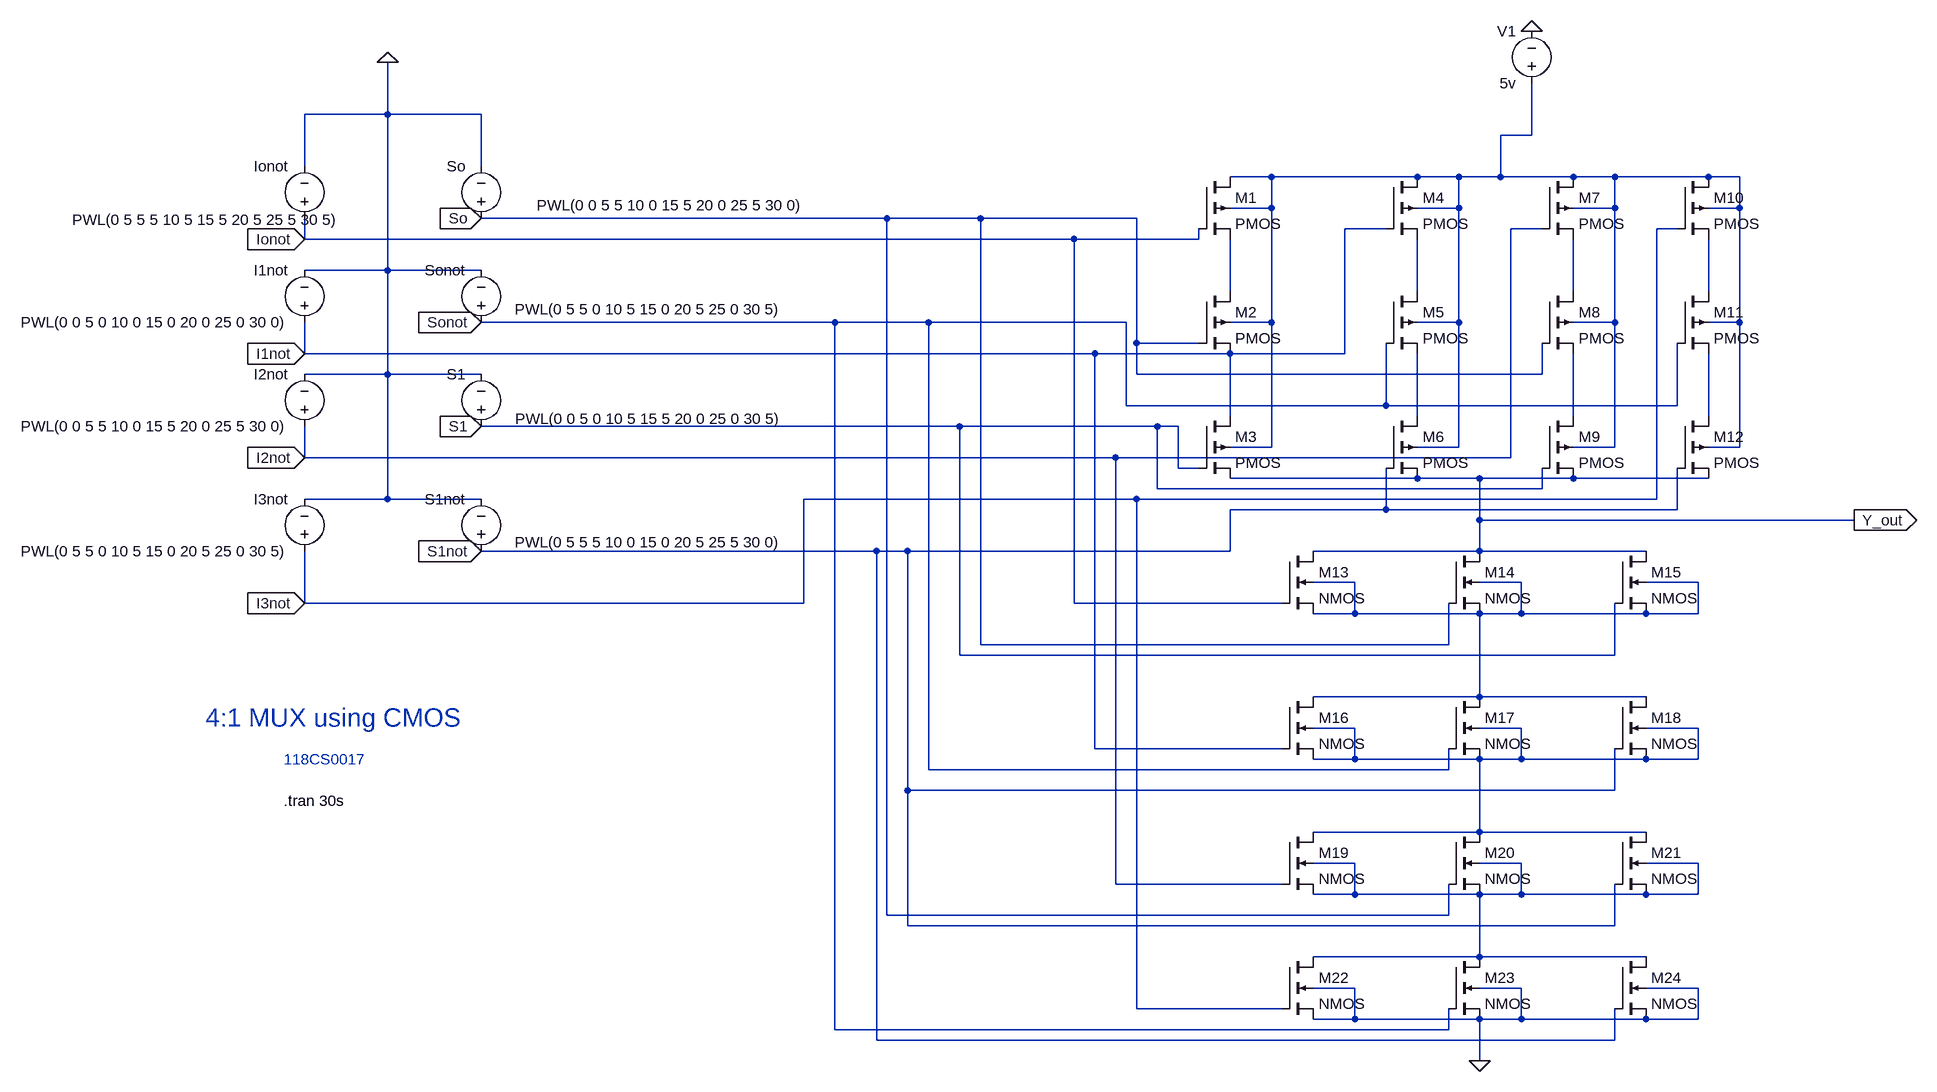
[diagram p0: schematic Draft11.asc]
Draft11.asc, the LTspice schematic file:
Version 4
SHEET 1 880 1492
WIRE -2128 -112 -2128 -192
WIRE -2128 -112 -2256 -112
WIRE -1984 -112 -2128 -112
WIRE -368 -80 -368 -160
WIRE -368 -80 -416 -80
WIRE -2256 -32 -2256 -112
WIRE -1984 -32 -1984 -112
WIRE -768 -16 -832 -16
WIRE -544 -16 -768 -16
WIRE -480 -16 -544 -16
WIRE -416 -16 -416 -80
WIRE -416 -16 -480 -16
WIRE -304 -16 -416 -16
WIRE -240 -16 -304 -16
WIRE -96 -16 -240 -16
WIRE -48 -16 -96 -16
WIRE -768 32 -768 -16
WIRE -768 32 -832 32
WIRE -480 32 -480 -16
WIRE -480 32 -544 32
WIRE -240 32 -240 -16
WIRE -240 32 -304 32
WIRE -48 32 -48 -16
WIRE -48 32 -96 32
WIRE -1360 48 -1984 48
WIRE -1216 48 -1360 48
WIRE -976 48 -1216 48
WIRE -592 64 -656 64
WIRE -352 64 -400 64
WIRE -144 64 -176 64
WIRE -2256 80 -2256 48
WIRE -1072 80 -2256 80
WIRE -880 80 -880 64
WIRE -880 80 -1072 80
WIRE -2128 128 -2128 -112
WIRE -2128 128 -2256 128
WIRE -1984 128 -2128 128
WIRE -832 160 -832 80
WIRE -544 160 -544 80
WIRE -304 160 -304 80
WIRE -96 160 -96 80
WIRE -1440 208 -1984 208
WIRE -1296 208 -1440 208
WIRE -992 208 -1296 208
WIRE -768 208 -768 32
WIRE -768 208 -832 208
WIRE -480 208 -480 32
WIRE -480 208 -544 208
WIRE -240 208 -240 32
WIRE -240 208 -304 208
WIRE -48 208 -48 32
WIRE -48 208 -96 208
WIRE -976 240 -976 48
WIRE -880 240 -976 240
WIRE -2256 256 -2256 208
WIRE -1040 256 -2256 256
WIRE -832 256 -1040 256
WIRE -656 256 -656 64
WIRE -656 256 -832 256
WIRE -2128 288 -2128 128
WIRE -2128 288 -2256 288
WIRE -1984 288 -2128 288
WIRE -976 288 -976 240
WIRE -352 288 -352 240
WIRE -352 288 -976 288
WIRE -992 336 -992 208
WIRE -592 336 -592 240
WIRE -592 336 -992 336
WIRE -144 336 -144 240
WIRE -144 336 -592 336
WIRE -832 352 -832 256
WIRE -544 352 -544 256
WIRE -304 352 -304 256
WIRE -96 352 -96 256
WIRE -1248 368 -1984 368
WIRE -944 368 -1248 368
WIRE -912 368 -944 368
WIRE -768 400 -768 208
WIRE -768 400 -832 400
WIRE -480 400 -480 208
WIRE -480 400 -544 400
WIRE -240 400 -240 208
WIRE -240 400 -304 400
WIRE -48 400 -48 208
WIRE -48 400 -96 400
WIRE -2256 416 -2256 368
WIRE -1008 416 -2256 416
WIRE -400 416 -400 64
WIRE -400 416 -1008 416
WIRE -912 432 -912 368
WIRE -880 432 -912 432
WIRE -544 448 -832 448
WIRE -448 448 -544 448
WIRE -304 448 -448 448
WIRE -96 448 -304 448
WIRE -944 464 -944 368
WIRE -352 464 -352 432
WIRE -352 464 -944 464
WIRE -2128 480 -2128 288
WIRE -2128 480 -2256 480
WIRE -1984 480 -2128 480
WIRE -976 480 -1488 480
WIRE -176 480 -176 64
WIRE -176 480 -976 480
WIRE -592 496 -592 432
WIRE -592 496 -832 496
WIRE -144 496 -144 432
WIRE -144 496 -592 496
WIRE -448 512 -448 448
WIRE 128 512 -448 512
WIRE -1376 560 -1984 560
WIRE -1328 560 -1376 560
WIRE -832 560 -832 496
WIRE -832 560 -1328 560
WIRE -448 560 -448 512
WIRE -448 560 -704 560
WIRE -192 560 -448 560
WIRE -640 608 -704 608
WIRE -384 608 -448 608
WIRE -112 608 -192 608
WIRE -2256 640 -2256 560
WIRE -1488 640 -1488 480
WIRE -1488 640 -2256 640
WIRE -1072 640 -1072 80
WIRE -752 640 -1072 640
WIRE -640 656 -640 608
WIRE -640 656 -704 656
WIRE -448 656 -640 656
WIRE -384 656 -384 608
WIRE -384 656 -448 656
WIRE -192 656 -384 656
WIRE -112 656 -112 608
WIRE -112 656 -192 656
WIRE -1216 704 -1216 48
WIRE -496 704 -496 640
WIRE -496 704 -1216 704
WIRE -1248 720 -1248 368
WIRE -240 720 -240 640
WIRE -240 720 -1248 720
WIRE -448 784 -448 656
WIRE -448 784 -704 784
WIRE -192 784 -448 784
WIRE -640 832 -704 832
WIRE -384 832 -448 832
WIRE -112 832 -192 832
WIRE -1040 864 -1040 256
WIRE -752 864 -1040 864
WIRE -640 880 -640 832
WIRE -640 880 -704 880
WIRE -448 880 -640 880
WIRE -384 880 -384 832
WIRE -384 880 -448 880
WIRE -192 880 -384 880
WIRE -112 880 -112 832
WIRE -112 880 -192 880
WIRE -1296 896 -1296 208
WIRE -496 896 -496 864
WIRE -496 896 -1296 896
WIRE -1328 928 -1328 560
WIRE -240 928 -240 864
WIRE -240 928 -1328 928
WIRE -448 992 -448 880
WIRE -448 992 -704 992
WIRE -192 992 -448 992
WIRE -640 1040 -704 1040
WIRE -384 1040 -448 1040
WIRE -112 1040 -192 1040
WIRE -1008 1072 -1008 416
WIRE -752 1072 -1008 1072
WIRE -640 1088 -640 1040
WIRE -640 1088 -704 1088
WIRE -448 1088 -640 1088
WIRE -384 1088 -384 1040
WIRE -384 1088 -448 1088
WIRE -192 1088 -384 1088
WIRE -112 1088 -112 1040
WIRE -112 1088 -192 1088
WIRE -1360 1120 -1360 48
WIRE -496 1120 -496 1072
WIRE -496 1120 -1360 1120
WIRE -1328 1136 -1328 928
WIRE -240 1136 -240 1072
WIRE -240 1136 -1328 1136
WIRE -448 1184 -448 1088
WIRE -448 1184 -704 1184
WIRE -192 1184 -448 1184
WIRE -640 1232 -704 1232
WIRE -384 1232 -448 1232
WIRE -112 1232 -192 1232
WIRE -976 1264 -976 480
WIRE -752 1264 -976 1264
WIRE -640 1280 -640 1232
WIRE -640 1280 -704 1280
WIRE -448 1280 -640 1280
WIRE -384 1280 -384 1232
WIRE -384 1280 -448 1280
WIRE -192 1280 -384 1280
WIRE -112 1280 -112 1232
WIRE -112 1280 -192 1280
WIRE -1440 1296 -1440 208
WIRE -496 1296 -496 1264
WIRE -496 1296 -1440 1296
WIRE -1376 1312 -1376 560
WIRE -240 1312 -240 1264
WIRE -240 1312 -1376 1312
WIRE -448 1344 -448 1280
FLAG -368 -240 0
FLAG -448 1344 0
FLAG 128 512 Y_out
IOPIN 128 512 Out
FLAG -2128 -192 0
FLAG -2256 80 Ionot
IOPIN -2256 80 In
FLAG -2256 256 I1not
IOPIN -2256 256 In
FLAG -2256 416 I2not
IOPIN -2256 416 In
FLAG -2256 640 I3not
IOPIN -2256 640 In
FLAG -1984 48 So
IOPIN -1984 48 In
FLAG -1984 208 Sonot
IOPIN -1984 208 In
FLAG -1984 368 S1
IOPIN -1984 368 In
FLAG -1984 560 S1not
IOPIN -1984 560 In
SYMBOL pmos4 -880 -16 R0
SYMATTR InstName M1
SYMBOL pmos4 -880 160 R0
SYMATTR InstName M2
SYMBOL pmos4 -880 352 R0
SYMATTR InstName M3
SYMBOL pmos4 -592 -16 R0
SYMATTR InstName M4
SYMBOL pmos4 -592 160 R0
SYMATTR InstName M5
SYMBOL pmos4 -592 352 R0
SYMATTR InstName M6
SYMBOL pmos4 -352 -16 R0
SYMATTR InstName M7
SYMBOL pmos4 -352 160 R0
SYMATTR InstName M8
SYMBOL pmos4 -352 352 R0
SYMATTR InstName M9
SYMBOL pmos4 -144 -16 R0
SYMATTR InstName M10
SYMBOL pmos4 -144 160 R0
SYMATTR InstName M11
SYMBOL pmos4 -144 352 R0
SYMATTR InstName M12
SYMBOL nmos4 -752 560 R0
SYMATTR InstName M13
SYMBOL nmos4 -496 560 R0
SYMATTR InstName M14
SYMBOL nmos4 -240 560 R0
SYMATTR InstName M15
SYMBOL nmos4 -752 784 R0
SYMATTR InstName M16
SYMBOL nmos4 -496 784 R0
SYMATTR InstName M17
SYMBOL nmos4 -240 784 R0
SYMATTR InstName M18
SYMBOL nmos4 -752 992 R0
SYMATTR InstName M19
SYMBOL nmos4 -496 992 R0
SYMATTR InstName M20
SYMBOL nmos4 -240 992 R0
SYMATTR InstName M21
SYMBOL nmos4 -752 1184 R0
SYMATTR InstName M22
SYMBOL nmos4 -496 1184 R0
SYMATTR InstName M23
SYMBOL nmos4 -240 1184 R0
SYMATTR InstName M24
SYMBOL voltage -368 -144 R180
WINDOW 0 24 96 Left 2
WINDOW 3 24 16 Left 2
SYMATTR InstName V1
SYMATTR Value 5v
SYMBOL voltage -2256 64 R180
WINDOW 0 24 96 Left 2
WINDOW 3 -55 14 Left 2
WINDOW 123 0 0 Left 0
WINDOW 39 0 0 Left 0
SYMATTR InstName Ionot
SYMATTR Value PWL(0 5 5 5 10 5 15 5 20 5 25 5 30 5)
SYMBOL voltage -2256 224 R180
WINDOW 0 24 96 Left 2
WINDOW 3 24 16 Left 2
WINDOW 123 0 0 Left 0
WINDOW 39 0 0 Left 0
SYMATTR InstName I1not
SYMATTR Value PWL(0 0 5 0 10 0 15 0 20 0 25 0 30 0)
SYMBOL voltage -2256 384 R180
WINDOW 0 24 96 Left 2
WINDOW 3 24 16 Left 2
WINDOW 123 0 0 Left 0
WINDOW 39 0 0 Left 0
SYMATTR InstName I2not
SYMATTR Value PWL(0 0 5 5 10 0 15 5 20 0 25 5 30 0)
SYMBOL voltage -2256 576 R180
WINDOW 0 24 96 Left 2
WINDOW 3 24 16 Left 2
WINDOW 123 0 0 Left 0
WINDOW 39 0 0 Left 0
SYMATTR InstName I3not
SYMATTR Value PWL(0 5 5 0 10 5 15 0 20 5 25 0 30 5)
SYMBOL voltage -1984 64 R180
WINDOW 0 24 96 Left 2
WINDOW 3 -498 36 Left 2
WINDOW 123 0 0 Left 0
WINDOW 39 0 0 Left 0
SYMATTR InstName So
SYMATTR Value PWL(0 0 5 5 10 0 15 5 20 0 25 5 30 0)
SYMBOL voltage -1984 224 R180
WINDOW 0 24 96 Left 2
WINDOW 3 -464 36 Left 2
WINDOW 123 0 0 Left 0
WINDOW 39 0 0 Left 0
SYMATTR InstName Sonot
SYMATTR Value PWL(0 5 5 0 10 5 15 0 20 5 25 0 30 5)
SYMBOL voltage -1984 384 R180
WINDOW 0 24 96 Left 2
WINDOW 3 -465 28 Left 2
WINDOW 123 0 0 Left 0
WINDOW 39 0 0 Left 0
SYMATTR InstName S1
SYMATTR Value PWL(0 0 5 0 10 5 15 5 20 0 25 0 30 5)
SYMBOL voltage -1984 576 R180
WINDOW 0 24 96 Left 2
WINDOW 3 -464 30 Left 2
WINDOW 123 0 0 Left 0
WINDOW 39 0 0 Left 0
SYMATTR InstName S1not
SYMATTR Value PWL(0 5 5 5 10 0 15 0 20 5 25 5 30 0)
TEXT -2408 816 Left 4 ;4:1 MUX using CMOS
TEXT -2288 944 Left 2 !.tran 30s
TEXT -2288 880 Left 2 ;118CS0017

The netlist it stands for:
* Draft11.asc
M1 N001 Ionot N002 N001 PMOS
M2 N002 So I1not N001 PMOS
M3 I1not S1 Y_out N001 PMOS
M4 N001 I1not N003 N001 PMOS
M5 N003 Sonot N006 N001 PMOS
M6 N006 S1not Y_out N001 PMOS
M7 N001 I2not N004 N001 PMOS
M8 N004 So N007 N001 PMOS
M9 N007 S1 Y_out N001 PMOS
M10 N001 I3not N005 N001 PMOS
M11 N005 Sonot N008 N001 PMOS
M12 N008 S1not Y_out N001 PMOS
M13 Y_out Ionot N009 N009 NMOS
M14 Y_out So N009 N009 NMOS
M15 Y_out S1 N009 N009 NMOS
M16 N009 I1not N010 N010 NMOS
M17 N009 Sonot N010 N010 NMOS
M18 N009 S1not N010 N010 NMOS
M19 N010 I2not N011 N011 NMOS
M20 N010 So N011 N011 NMOS
M21 N010 S1not N011 N011 NMOS
M22 N011 I3not 0 0 NMOS
M23 N011 Sonot 0 0 NMOS
M24 N011 S1not 0 0 NMOS
V1 N001 0 5v
V§Ionot Ionot 0 PWL(0 5 5 5 10 5 15 5 20 5 25 5 30 5)
V§I1not I1not 0 PWL(0 0 5 0 10 0 15 0 20 0 25 0 30 0)
V§I2not I2not 0 PWL(0 0 5 5 10 0 15 5 20 0 25 5 30 0)
V§I3not I3not 0 PWL(0 5 5 0 10 5 15 0 20 5 25 0 30 5)
V§So So 0 PWL(0 0 5 5 10 0 15 5 20 0 25 5 30 0)
V§Sonot Sonot 0 PWL(0 5 5 0 10 5 15 0 20 5 25 0 30 5)
V§S1 S1 0 PWL(0 0 5 0 10 5 15 5 20 0 25 0 30 5)
V§S1not S1not 0 PWL(0 5 5 5 10 0 15 0 20 5 25 5 30 0)
.model NMOS NMOS
.model PMOS PMOS
.lib standard.mos
* 4:1 MUX using CMOS
.tran 30s
* 118CS0017
.backanno
.end